# Altium schematic sheet ESP_Grow_Main_Rev_B_3_ChangeLog.SchDoc
size A
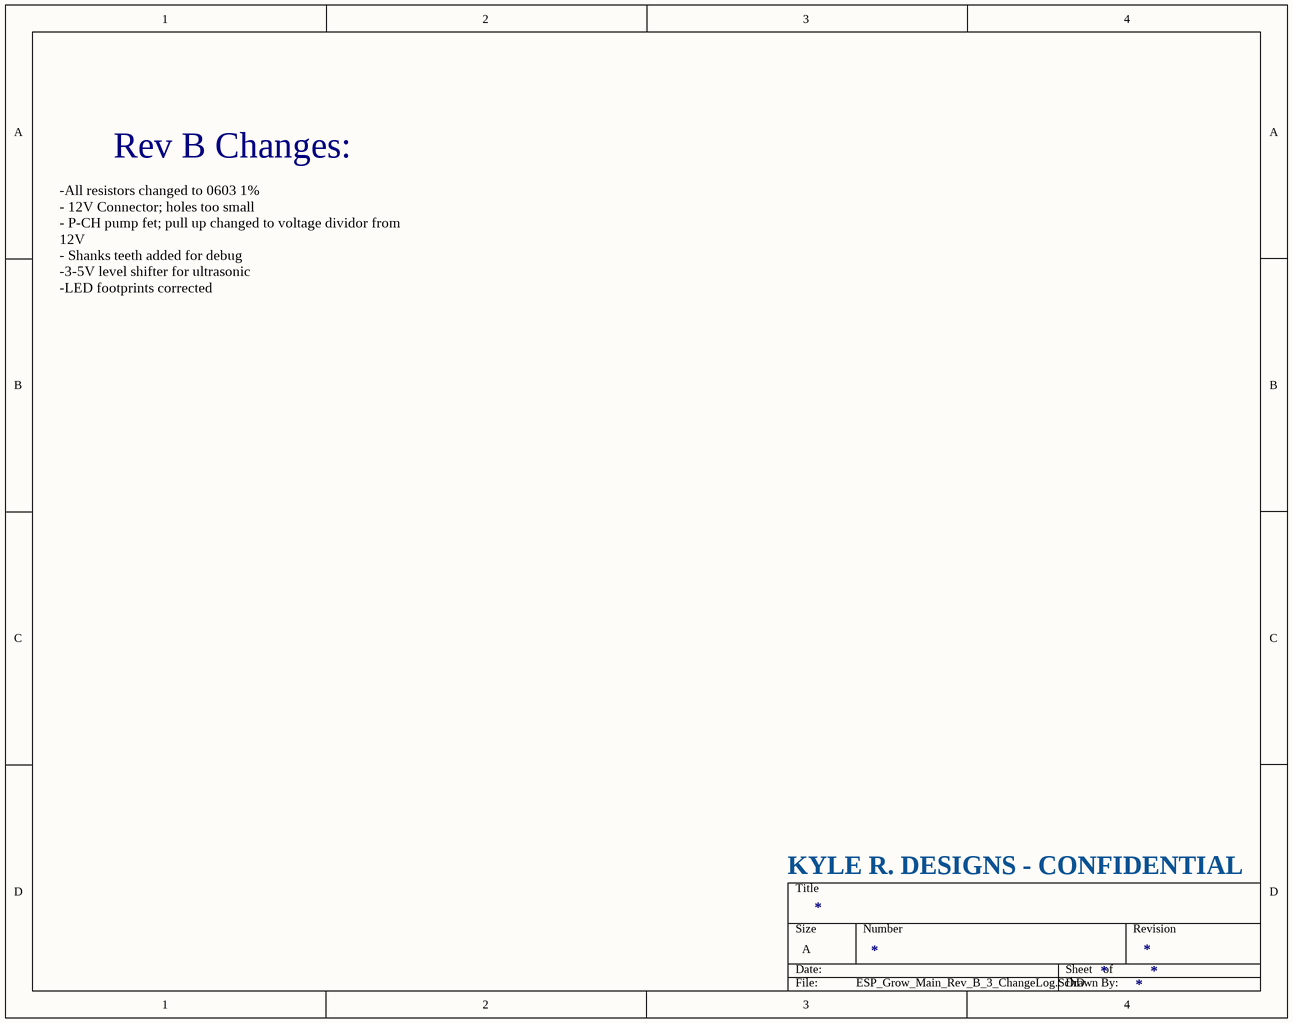
[diagram p0: ESP_Grow_Main_Rev_B_3_ChangeLog.SchDoc]

## Notes on the sheet
- Rev B Changes:
- -All resistors changed to 0603 1%
  - 12V Connector; holes too small
  - P-CH pump fet; pull up changed to voltage dividor from 12V
  - Shanks teeth added for debug
  -3-5V level shifter for ultrasonic
  -LED footprints corrected
- KYLE R. DESIGNS - CONFIDENTIAL